# EAGLE design BusPirate-v25 (EAGLE 5.03)
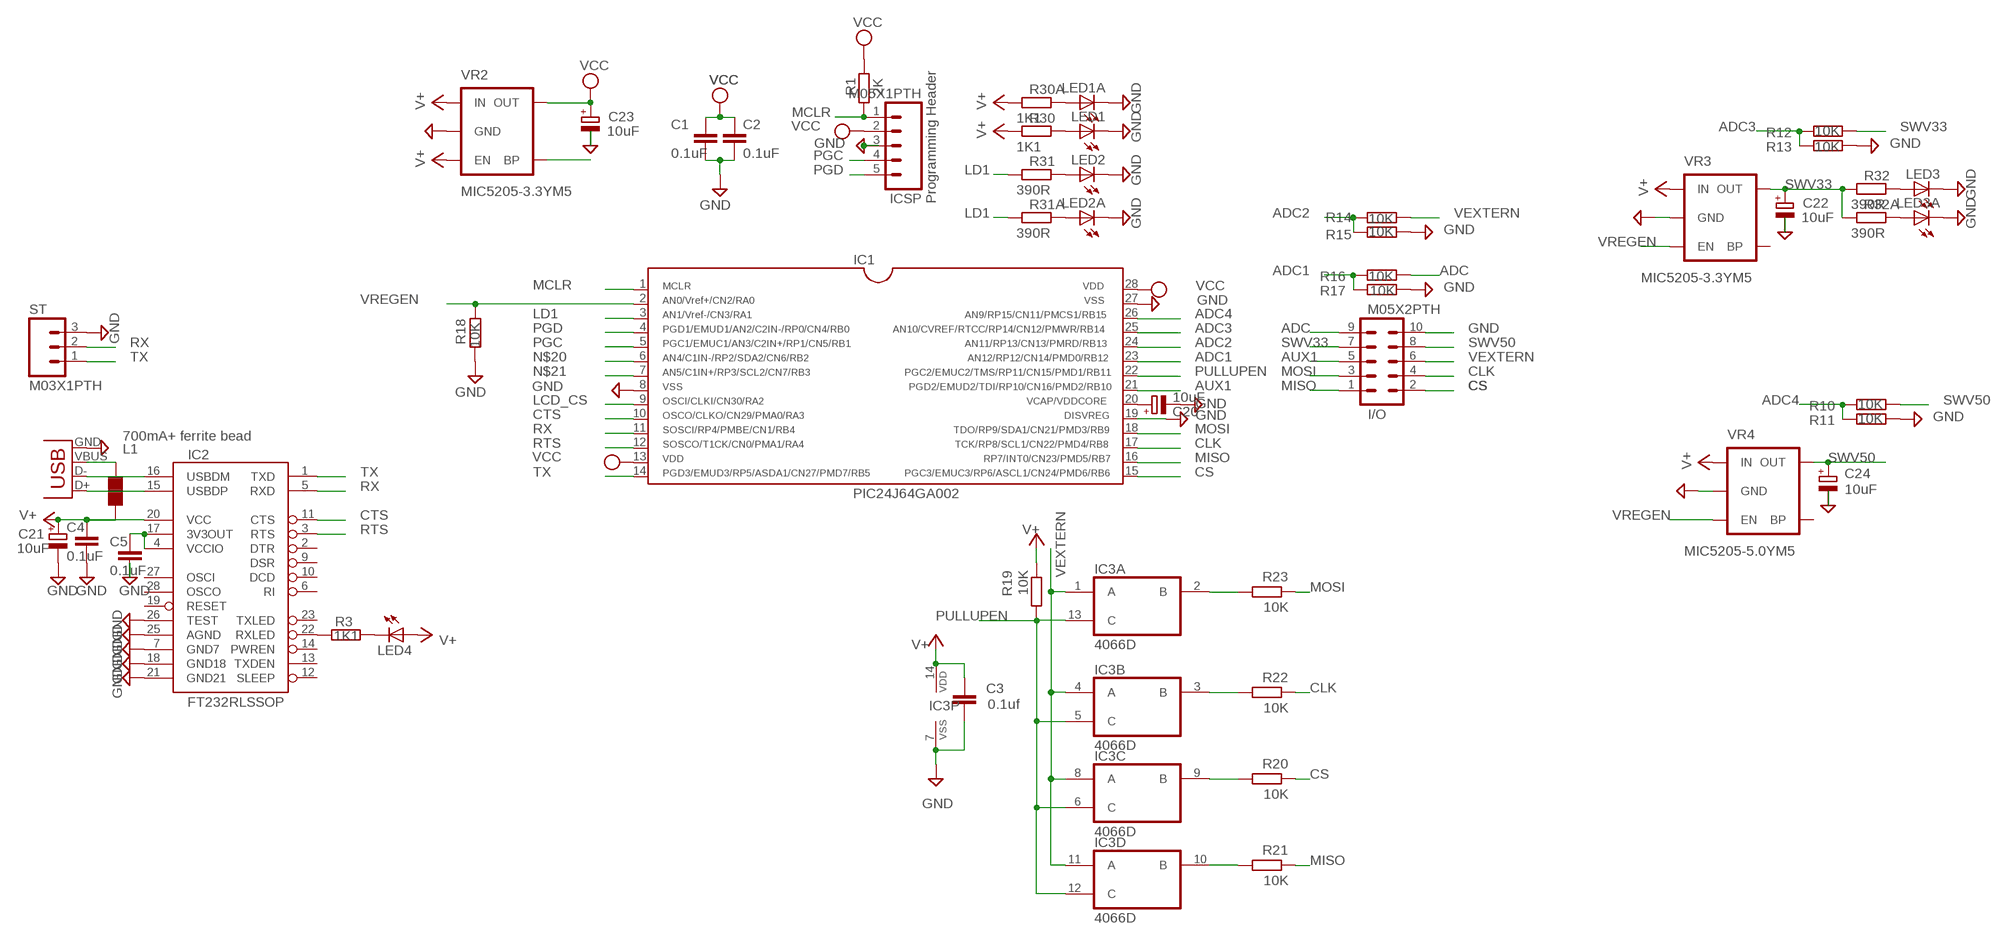
[diagram p0: schematic, sheet 1]

## Parts
C1  0.1uF  C-EUC0805  [C0805]
C2  0.1uF  C-EUC0805  [C0805]
C3  0.1uf  C-EUC0805  [C0805]
C4  0.1uF  C-EUC0805  [C0805]
C5  0.1uF  C-EUC0805  [C0805]
C20  10uF  CPOL-EUSMCA  [SMC_A]
C21  10uF  CPOL-EUSMCA  [SMC_A]
C22  10uF  CPOL-EUSMCA  [SMC_A]
C23  10uF  CPOL-EUSMCA  [SMC_A]
C24  10uF  CPOL-EUSMCA  [SMC_A]
I/O  M05X2PTH  [AVR_ICSP]
IC1  PIC24J64GA002  PIC24FJ64GA002  [SO28W]
IC2  FT232RLSSOP  [SSOP28DB]
IC3  4066D  [SO14]
ICSP  M05X1PTH  M05  [1X05]
J2  USBSMD  [USB-MINIB]
L1  700mA+ ferrite bead  WE-KIL_0805  [WE-KI_0805_B]
LED1  LEDCHIP-LED0805  [CHIP-LED0805]
LED1A  LEDCHIP-LED0805  [CHIP-LED0805]
LED2  LEDCHIP-LED0805  [CHIP-LED0805]
LED2A  LEDCHIP-LED0805  [CHIP-LED0805]
LED3  LEDCHIP-LED0805  [CHIP-LED0805]
LED3A  LEDCHIP-LED0805  [CHIP-LED0805]
LED4  LEDCHIP-LED0805  [CHIP-LED0805]
R1  2K  R-EU_R0805  [R0805]
R3  1K1  R-EU_M0805  [M0805]
R10  10K  R-EU_M0805  [M0805]
R11  10K  R-EU_M0805  [M0805]
R12  10K  R-EU_M0805  [M0805]
R13  10K  R-EU_M0805  [M0805]
R14  10K  R-EU_M0805  [M0805]
R15  10K  R-EU_M0805  [M0805]
R16  10K  R-EU_M0805  [M0805]
R17  10K  R-EU_M0805  [M0805]
R18  10K  R-EU_M0805  [M0805]
R19  10K  R-EU_R0805  [R0805]
R20  10K  R-EU_R0805  [R0805]
R21  10K  R-EU_R0805  [R0805]
R22  10K  R-EU_R0805  [R0805]
R23  10K  R-EU_R0805  [R0805]
R30  1K1  R-EU_M0805  [M0805]
R30A  1K1  R-EU_M0805  [M0805]
R31  390R  R-EU_M0805  [M0805]
R31A  390R  R-EU_M0805  [M0805]
R32  390R  R-EU_M0805  [M0805]
R32A  390R  R-EU_M0805  [M0805]
ST  M03X1PTH  M03PTH  [1X03]
VR2  MIC5205-3.3YM5  V_REG_LDOSMD  [SOT23-5]
VR3  MIC5205-3.3YM5  V_REG_LDOSMD  [SOT23-5]
VR4  MIC5205-5.0YM5  V_REG_LDOSMD  [SOT23-5]

## Nets
$N26: J2.VBUS L1.2
ADC: I/O.9 R16.1
ADC1: IC1.23 R16.2 R17.2
ADC2: IC1.24 R14.2 R15.2
ADC3: IC1.25 R12.2 R13.2
ADC4: IC1.26 R10.2 R11.2
AUX1: I/O.5 IC1.21
CLK: I/O.4 IC1.17 R22.1
CS: I/O.2 IC1.15 R20.1
CTS: IC1.10 IC2.11(CTS)
GND: C1.2 C2.2 C3.2 C4.2 C5.2 C20.- C21.- C22.- C23.- C24.- I/O.10 IC1.8 IC1.19 IC1.27 IC2.7(GND7) IC2.18(GND18) IC2.21(GND21) IC2.25(AGND) IC2.26(TEST) IC3.7(P:VSS) ICSP.3 J2.GND LED1.C LED1A.C LED2.C LED2A.C LED3.C LED3A.C R11.1 R13.1 R15.1 R17.1 R18.2 ST.3 VR2.2(GND) VR3.2(GND) VR4.2(GND)
LCD_CS: IC1.9
LD1: IC1.3 R31.2 R31A.2
MCLR: IC1.1 ICSP.1 R1.1
MISO: I/O.1 IC1.16 R21.1
MOSI: I/O.3 IC1.18 R23.1
N$1: IC3.2(A:B) R23.2
N$2: IC3.3(B:B) R22.2
N$3: C20.+ IC1.20
N$4: IC3.10(D:B) R21.2
N$5: IC3.9(C:B) R20.2
N$6: LED2.A R31.1
N$7: LED1.A R30.1
N$8: VR2.4(BP)
N$9: LED3A.A R32A.1
N$11: IC2.22(RXLED) R3.2
N$13: LED4.C R3.1
N$14: LED2A.A R31A.1
N$15: IC2.15(USBDP) J2.D+
N$16: IC2.16(USBDM) J2.D-
N$17: LED1A.A R30A.1
N$18: LED3.A R32.1
N$20: IC1.6
N$21: IC1.7
PGC: IC1.5 ICSP.4
PGD: IC1.4 ICSP.5
PULLUPEN: IC1.22 IC3.5(B:C) IC3.6(C:C) IC3.12(D:C) IC3.13(A:C) R19.2
RTS: IC1.12 IC2.3(RTS)
RX: IC1.11 IC2.5(RXD) ST.2
SWV33: C22.+ I/O.7 R12.1 R32.2 R32A.2 VR3.5(OUT)
SWV50: C24.+ I/O.8 R10.1 VR4.5(OUT)
TX: IC1.14 IC2.1(TXD) ST.1
USBVCCIO: C5.1 IC2.4(VCCIO) IC2.17(3V3OUT)
V+: C3.1 C4.1 C21.+ IC2.20(VCC) IC3.14(P:VDD) L1.1 LED4.A R19.1 R30.2 R30A.2 VR2.1(IN) VR2.3(EN) VR3.1(IN) VR4.1(IN)
VCC: C1.1 C2.1 C23.+ IC1.13 IC1.28 ICSP.2 R1.2 VR2.5(OUT)
VEXTERN: I/O.6 IC3.1(A:A) IC3.4(B:A) IC3.8(C:A) IC3.11(D:A) R14.1
VREGEN: IC1.2 R18.1 VR3.3(EN) VR4.3(EN)
Unconnected: IC2.2(DTR) IC2.6(RI) IC2.9(DSR) IC2.10(DCD) IC2.12(SLEEP) IC2.13(TXDEN) IC2.14(PWREN) IC2.19(RESET) IC2.23(TXLED) IC2.27(OSCI) IC2.28(OSCO) VR3.4(BP) VR4.4(BP)

## Notes on the sheet
- Programming Header

## Library data of the parts
C1-C5 = rcl:C-EU: CAPACITOR, European symbol
C20-C24 = rcl:CPOL-EU: POLARIZED CAPACITOR, European symbol
I/O = SparkFun:M05X2: Header 5x2 Standard 10-pin dual row 0.1" header. Commonly used with AVR-ISP. Use with Spark Fun Electronics SKU: PRT-00778
IC1 = microchip-pic24:PIC24FJ64GA002
IC2 = SparkFun:FT232RL: USB UART FT232RL 4th Generation USB UART (USB <-> Serial) Controller. Spark Fun Electronics SKU : COM-00650
IC3 = 40xx:4066: Quad bilateral ANALOG SWITCH
ICSP = SparkFun:M05: Header 5 Standard 5-pin 0.1" header. Use with straight break away headers (SKU : PRT-00116), right angle break away headers (PRT-00553), swiss pins (PRT-00743), machine pins (PRT-00117), and female headers (PRT-00115). Molex polarized connector foot print use with SKU : PRT-08230 with associated crimp pins and housings.
J2 = SparkFun:USB: USB Connectors USB-B-PTH is fully proven SKU : PRT-00139 USB-miniB is fully proven SKU : PRT-00587 USB-A-PCB is untested. USB-A-H is throughly reviewed, but untested. Spark Fun Electronics SKU : PRT-00437 USB-B-SMT is throughly reviewed, but untested. Needs silkscreen touching up. USB-A-S has not been used/tested USB-MB-H has not been used/tested
L1 = wuerth-elektronik:WE-KIL: SMD Wire Wound Ceramic Inductor WE-KIL - Low profile - High Q values -- Bluetooth -- Wireless LAN -- RF oscillation circuit -- IF impedance matching
LED1 LED1A LED2 LED2A LED3 LED3A LED4 = led:LED: LED OSRAM: - CHIPLED LG R971, LG N971, LY N971, LG Q971, LY Q971, LO R971, LY R971 LH N974, LH R974 LS Q976, LO Q976, LY Q976 LO Q996 - Hyper CHIPLED LW Q18S LB Q993, LB Q99A, LB R99A - SideLED LS A670, LO A670, LY A670, LG A670, LP A670 LB A673, LV A673, LT A673, LW A673 LH A674 LY A675 LS A676, LA A676, LO A676, LY A676, LW A676 LS A679, LY A679, LG A679 - Hyper Micro SIDELED® LS Y876, LA Y876, LO Y876, LY Y876 LT Y87S - SmartLED LW L88C, LW L88S LB L89C, LB L89S, LG L890 LS L89K, LO L89K, LY L89K LS L896, LA L896, LO L896, LY L896 - TOPLED LS T670, LO T670, LY T670, LG T670, LP T670 LSG T670, LSP T670, LSY T670, LOP T670, LYG T670 LG T671, LOG T671, LSG T671 LB T673, LV T673, LT T673, LW T673 LH T674 LS T676, LA T676, LO T676, LY T676, LB T676, LH T676, LSB T676, LW T676 LB T67C, LV T67C, LT T67C, LS T67K, LO T67K, LY T67K, LW E67C LS E67B, LA E67B, LO E67B, LY E67B, LB E67C, LV E67C, LT E67C LW T67C LS T679, LY T679, LG T679 LS T770, LO T770, LY T770, LG T770, LP T770 LB T773, LV T773, LT T773, LW T773 LH T774 LS E675, LA E675, LY E675, LS T675 LS T776, LA T776, LO T776, LY T776, LB T776 LHGB T686 LT T68C, LB T68C - Hyper Mini TOPLED® LB M676 - Mini TOPLED Santana® LG M470 LS M47K, LO M47K, LY M47K Source: http://www.osram.convergy.de LUXEON: - LUMILED® LXK2-PW12-R00, LXK2-PW12-S00, LXK2-PW14-U00, LXK2-PW14-V00 LXK2-PM12-R00, LXK2-PM12-S00, LXK2-PM14-U00 LXK2-PE12-Q00, LXK2-PE12-R00, LXK2-PE12-S00, LXK2-PE14-T00, LXK2-PE14-U00 LXK2-PB12-K00, LXK2-PB12-L00, LXK2-PB12-M00, LXK2-PB14-N00, LXK2-PB14-P00, LXK2-PB14-Q00 LXK2-PR12-L00, LXK2-PR12-M00, LXK2-PR14-Q00, LXK2-PR14-R00 LXK2-PD12-Q00, LXK2-PD12-R00, LXK2-PD12-S00 LXK2-PH12-R00, LXK2-PH12-S00 LXK2-PL12-P00, LXK2-PL12-Q00, LXK2-PL12-R00 Source: www.luxeon.com KINGBRIGHT: KA-3528ASYC Source: www.kingbright.com
R1 R19-R23 R30 R30A R31 R31A R32 R32A = rcl:R-EU_: RESISTOR, European symbol
R3 R10-R18 = resistor:R-EU_: RESISTOR, European symbol
ST = SparkFun:M03: Header 3 Standard 3-pin 0.1" header. Use with straight break away headers (SKU : PRT-00116), right angle break away headers (PRT-00553), swiss pins (PRT-00743), machine pins (PRT-00117), and female headers (PRT-00115). Molex polarized connector foot print use with SKU : PRT-08232 with associated crimp pins and housings.
VR2-VR4 = SparkFun:V_REG_LDO: Voltage Regulator LDO Standard 150mA LDO voltage regulator in SOT-23 layout. Micrel part MIC5205. BP (by-pass) pin is used to lower output noise with 470pF cap.

## Board
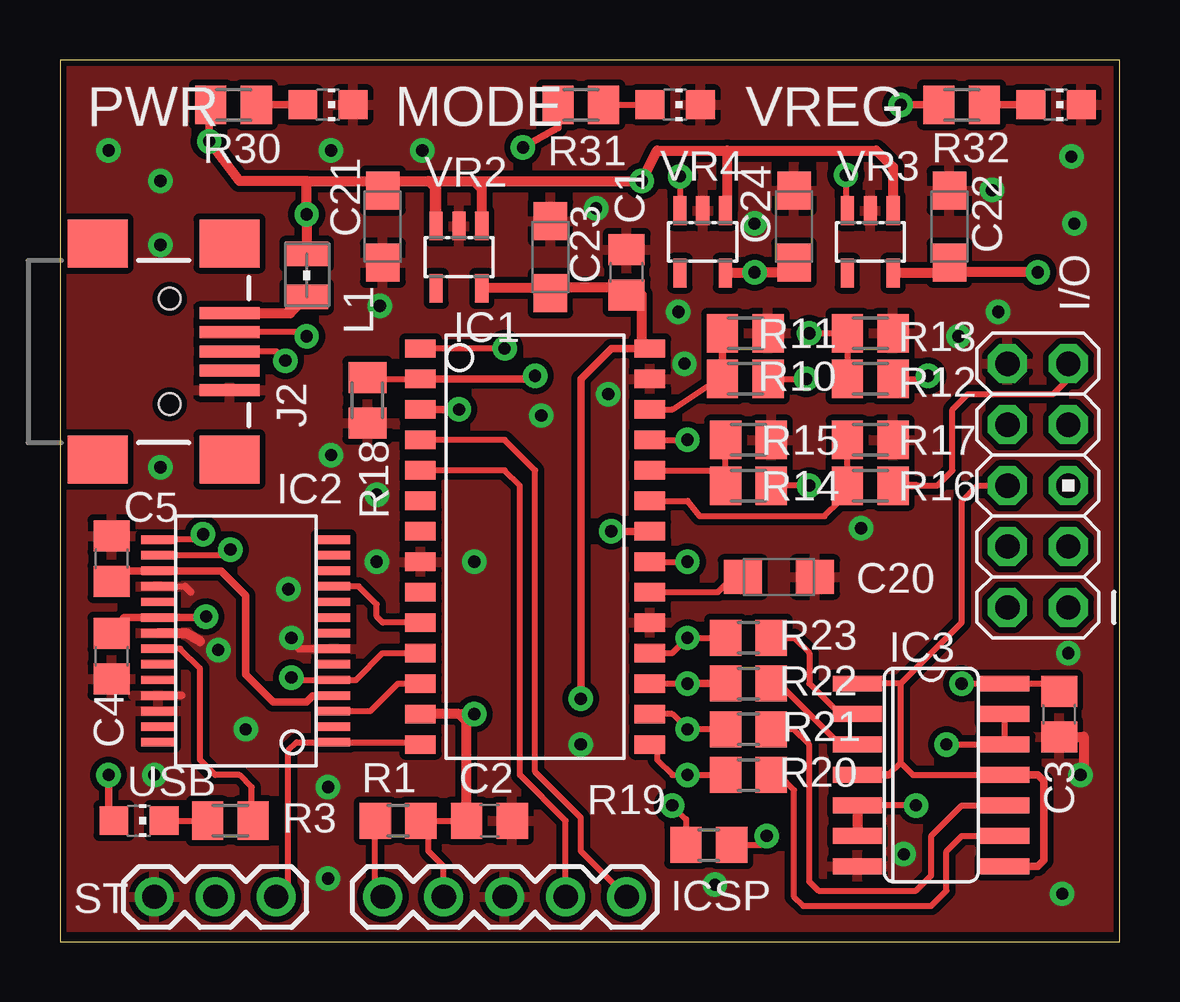
[diagram p1: board, top side]
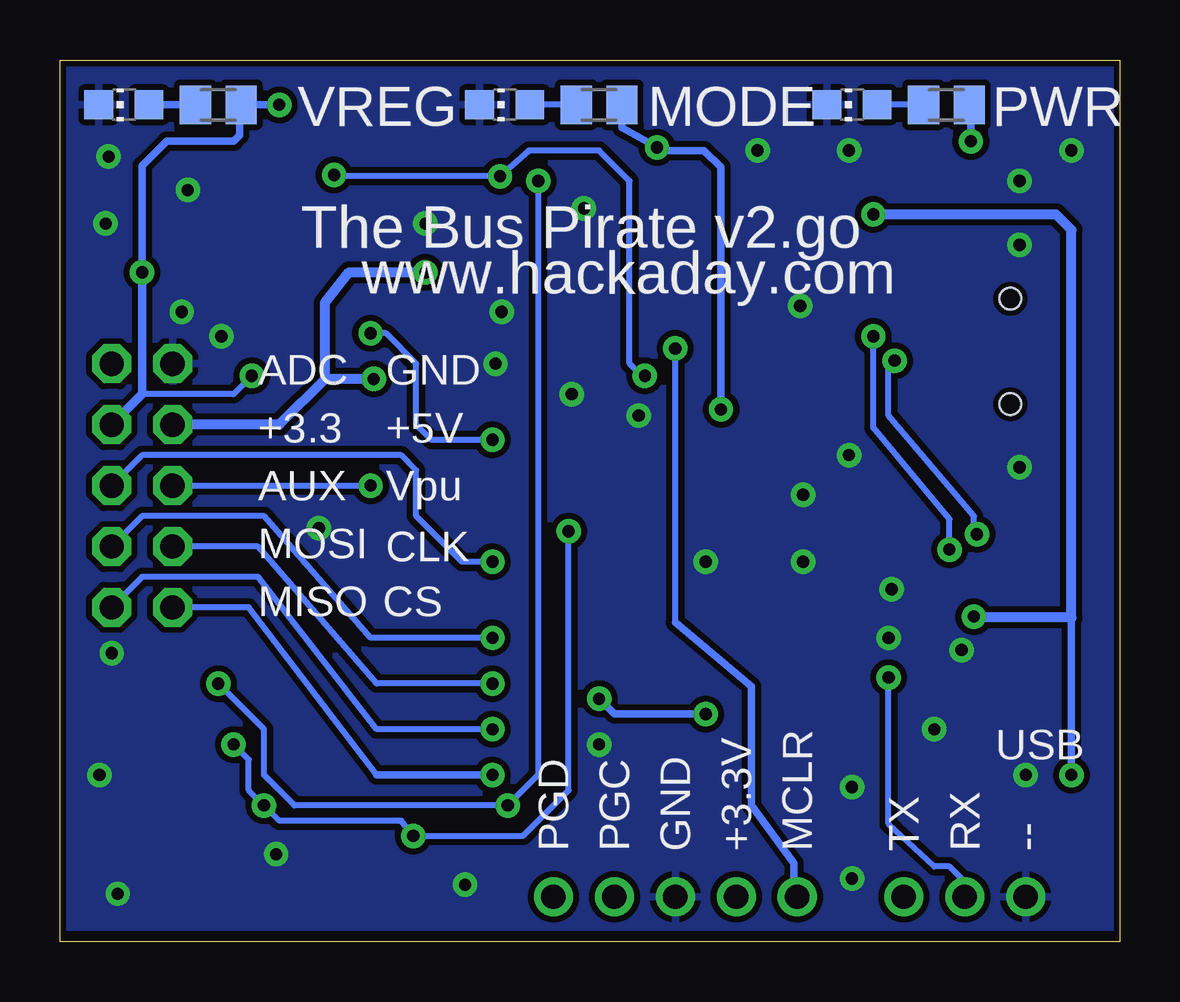
[diagram p2: board, bottom side, seen from below]

Size 44.19 x 36.75 mm. Coordinates in mm from the lower left corner, seen from the top.
Outline: 44.19,0 44.19,36.75 0,36.75 0,0 44.19,0
Copper layers (1*16): Top 0.035mm / dielectric 1.5mm / Bottom 0.035mm
Design rules "SparkFun": minimum track width 8mil, minimum drill 20mil, track to track 8mil, track to pad 8mil, pad to pad 8mil, via to via 8mil, smd to smd 8mil, copper to edge 10mil, drill to drill 8mil, minimum pad ring 12mil, minimum via ring 10mil, stop-mask expansion 4mil, vias tented up to drill 25mil, thermal gap 10mil

### Footprints (pad centres in the part's own frame; a part is rotated, then mirrored left to right if it is on the bottom)
C0805 = smd 1.3 x 1.5: 1 -0.95,0; 2 0.95,0
SMC_A = smd 1.6 x 1.4: + -1.5,0; - 1.5,0
AVR_ICSP = drill 1.016 octagon: 1 -1.27,5.08; 2 1.27,5.08; 3 -1.27,2.54; 4 1.27,2.54; 5 -1.27,0; 6 1.27,0; 7 -1.27,-2.54; 8 1.27,-2.54; 9 -1.27,-5.08; 10 1.27,-5.08
SO28W = smd 0.762 x 1.27: 1 -8.89,-4.78; 2 -7.62,-4.78; 3 -6.35,-4.78; 4 -5.08,-4.78; 5 -3.81,-4.78; 6 -2.54,-4.78; 7 -1.27,-4.78; 8 0,-4.78; 9 1.27,-4.78; 10 2.54,-4.78; 11 3.81,-4.78; 12 5.08,-4.78; 13 6.35,-4.78; 14 7.62,-4.78; 15 7.62,4.78; 16 6.35,4.78; 17 5.08,4.78; 18 3.81,4.78; 19 2.54,4.78; 20 1.27,4.78; 21 0,4.78; 22 -1.27,4.78; 23 -2.54,4.78; 24 -3.81,4.78; 25 -5.08,4.78; 26 -6.35,4.78; 27 -7.62,4.78; 28 -8.89,4.78
SSOP28DB = smd 0.348 x 1.397: 1 -4.225,-3.656; 2 -3.575,-3.656; 3 -2.925,-3.656; 4 -2.275,-3.656; 5 -1.625,-3.656; 6 -0.975,-3.656; 7 -0.325,-3.656; 8 0.325,-3.656; 9 0.975,-3.656; 10 1.625,-3.656; 11 2.275,-3.656; 12 2.925,-3.656; 13 3.575,-3.656; 14 4.225,-3.656; 15 4.225,3.656; 16 3.575,3.656; 17 2.925,3.656; 18 2.275,3.656; 19 1.625,3.656; 20 0.975,3.656; 21 0.325,3.656; 22 -0.325,3.656; 23 -0.975,3.656; 24 -1.625,3.656; 25 -2.275,3.656; 26 -2.925,3.656; 27 -3.575,3.656; 28 -4.225,3.656
SO14 = smd 0.66 x 2.032: 1 -3.81,-3.073; 2 -2.54,-3.073; 3 -1.27,-3.073; 4 0,-3.073; 5 1.27,-3.073; 6 2.54,-3.073; 7 3.81,-3.073; 8 3.81,3.073; 9 2.54,3.073; 10 1.27,3.073; 11 0,3.073; 12 -1.27,3.073; 13 -2.54,3.073; 14 -3.81,3.073
1X05 = drill 1.016 round: 1 0,0; 2 2.54,0; 3 5.08,0; 4 7.62,0; 5 10.16,0
USB-MINIB = smd 2.5 x 0.5: D+ 2.5,0; D- 2.5,0.8; GND 2.5,-1.6; ID 2.5,-0.8; VBUS 2.5,1.6 | smd 2.5 x 2: GND@1 -3,-4.5; GND@2 -3,4.5; GND@3 2.5,4.5; GND@4 2.5,-4.5 | hole 0.9: 0,2.2; 0,-2.2
WE-KI_0805_B = smd 1.02 x 1.78: 1 -0.89,0; 2 0.89,0
CHIP-LED0805 = smd 1.2 x 1.2: A 0,-1.05; C 0,1.05
R0805 = smd 1.3 x 1.5: 1 -0.95,0; 2 0.95,0
M0805 = smd 1.3 x 1.6: 1 -0.95,0; 2 0.95,0
1X03 = drill 1.016 round: 1 0,0; 2 2.54,0; 3 5.08,0
SOT23-5 = smd 0.55 x 1.2: 1 -0.95,-1.3; 2 0,-1.3; 3 0.95,-1.3; 4 0.95,1.3; 5 -0.95,1.3

### Placement (x,y rotation side)
C1  23.62,27.9 90 top
C2  17.9,5.04 0 top
C3  41.65,9.49 270 top
C4  2.15,11.9 270 top
C5  2.15,15.96 90 top
C20  29.97,15.2 0 top
C21  13.46,29.81 270 top
C22  37.08,29.81 90 top
C23  20.44,28.54 90 top
C24  30.6,29.81 90 top
I/O  40.76,19.01 180 top
IC1  19.81,15.84 270 top
IC2  7.74,12.54 90 top
IC3  36.32,6.95 270 top
ICSP  13.46,1.87 0 top
J2  4.57,24.6 0 top
L1  10.28,27.78 270 top
LED1  11.17,34.89 270 top
LED1A  11.17,34.89 90 bottom
LED2  25.65,34.89 270 top
LED2A  25.65,34.89 90 bottom
LED3  41.52,34.89 270 top
LED3A  41.52,34.89 90 bottom
LED4  3.3,5.04 270 top
R1  14.09,5.04 0 top
R3  7.11,5.04 0 top
R10  28.57,23.46 180 top
R11  28.57,25.36 180 top
R12  33.78,23.46 180 top
R13  33.78,25.36 180 top
R14  28.7,19.01 180 top
R15  28.7,20.92 180 top
R16  33.78,19.01 180 top
R17  33.78,20.92 180 top
R18  12.82,22.57 270 top
R19  27.05,4.03 0 top
R20  28.7,6.95 0 top
R21  28.7,8.85 0 top
R22  28.7,10.76 0 top
R23  28.7,12.66 0 top
R30  7.23,34.89 180 top
R30A  7.23,34.89 0 bottom
R31  21.71,34.89 180 top
R31A  21.71,34.89 0 bottom
R32  37.59,34.89 180 top
R32A  37.59,34.89 0 bottom
ST  9.01,1.87 180 top
VR2  16.63,28.54 180 top
VR3  33.78,29.17 180 top
VR4  26.79,29.17 180 top

### Tracks (layer width: path | path; a pad name or v marks a point on that pad's centre or on a via)
$N26
  Top 0.406: J2.VBUS 9.6,26.2 L1.2
ADC
  Top 0.254: I/O.9 42.03,23.46 41.4,22.82 37.84,22.82 37.21,22.19 37.21,19.65 36.57,19.01 35.68,19.01
  Top 0.305: R16.1 35.68,19.01
ADC1
  Top 0.254: IC1.23 26.16,18.38 26.66,17.74 31.87,17.74 32.51,18.38 32.83,18.38 R16.2 R17.2
ADC2
  Top 0.254: IC1.24 27.75,19.65 | 27.75,19.65 R15.2 | 27.75,19.65 R14.2
ADC3  (via drill 0.51)
  Top 0.254: IC1.25 v26.16,20.92 | v31.24,25.36 R13.2 R12.2
  Top 0.305: R13.2 32.83,25.68
  Bottom 0.254: v31.24,25.36 30.6,25.36 29.33,24.09 29.33,21.55 28.7,20.92 v26.16,20.92
ADC4
  Top 0.254: IC1.26 25.52,22.19 27.43,23.46
  Top 0.305: R10.2 R11.2
  Top 0.406: 27.43,23.46 R10.2
AUX1  (via drill 0.51)
  Top 0.254: IC1.21 v26.16,15.84
  Bottom 0.254: v26.16,15.84 27.43,15.84 29.33,17.74 29.33,19.65 29.97,20.28 40.76,20.28 I/O.5
CLK  (via drill 0.51)
  Top 0.254: IC1.17 v26.16,10.76
  Top 0.305: v26.16,10.76 R22.1
  Bottom 0.254: I/O.4 35.94,16.47 30.98,10.76 v26.16,10.76
CS  (via drill 0.51)
  Top 0.254: R20.1 v26.16,6.95 25.52,6.95 24.89,7.58 24.89,7.92 IC1.15
  Top 0.305: IC1.15 24.89,8.22
  Bottom 0.254: I/O.2 36.32,13.93 30.98,6.95
  Bottom 0.305: v26.16,6.95 30.98,6.95
CTS
  Top 0.254: IC1.10 13.46,13.3 13.2,13.55 13.2,14.06 12.45,14.81 IC2.11
GND  (via drill 0.51)
  Top 0.254: IC2.18 5.21,14.81
  Top 0.305: IC2.7 9.97,12.21 9.65,12.54 | 5.21,14.81 5.46,14.57 | IC2.25 5.08,10.26
  Top 0.406: IC2.21 5.26,12.86 5.84,12.54 | C3.2 42.67,8.54 42.67,6.95
  other vias: 2.03,32.98 22.35,30.57 11.3,32.98 4.19,19.77 4.19,29.04 22.86,22.82 35.17,3.64 13.2,15.84 13.33,26.5 11.17,2.63 3.93,6.95 25.78,26.25 9.52,14.69 27.3,2.38 21.71,8.22 41.78,1.99 37.46,25.24 42.03,12.03 33.4,17.23 9.65,12.66 11.17,6.44 42.16,32.73 42.29,29.93 39.11,26.25 42.54,6.95 26.03,24.09 4.19,31.71 6.6,12.15 20.06,21.93 28.95,29.93 38.86,31.33 11.3,20.28 15.11,32.98 13.2,18.63 17.27,15.84 7.74,8.85
  pour Top (isolate 0.254): 0.12,36.79 43.94,36.79 43.94,0.6 0.12,0.6
  pour Bottom (isolate 0.254): 0.12,36.79 43.94,36.79 43.94,0.6 0.12,0.6
LD1  (via drill 0.51)
  Top 0.305: IC1.3 v16.63,22.19 | R31A.2 20.76,33.94 v19.3,33.11
  Bottom 0.305: v16.63,22.19 16.63,32.28 17.33,32.98 19.17,32.98 v19.3,33.11 20.76,33.94 R31A.2
MCLR  (via drill 0.51)
  Top 0.254: v18.54,24.73 IC1.1 | R1.1 13.14,2.18 ICSP.1
  Bottom 0.254: 18.54,13.3 v18.54,24.73 | ICSP.1 13.58,1.99
  Bottom 0.305: 13.58,1.99 13.58,3.26 15.36,5.68 15.36,10.63 18.54,13.3
MISO  (via drill 0.51)
  Top 0.254: IC1.16 25.52,9.49 v26.16,8.85 R21.1
  Bottom 0.254: I/O.1 40.76,15.2 35.94,15.2 30.98,8.85 v26.16,8.85
MOSI  (via drill 0.51)
  Top 0.254: IC1.18 25.52,12.03 v26.16,12.66 R23.1
  Bottom 0.254: I/O.3 40.76,17.74 35.68,17.74 31.24,12.66 v26.16,12.66
N$1
  Top 0.254: IC3.2 32.51,9.49 31.24,10.76 31.24,12.03 30.6,12.66 R23.2
N$2
  Top 0.254: R22.2 29.97,10.76 32.51,8.22 IC3.3
N$3
  Top 0.254: IC1.20 27.43,14.57 28.06,15.2 C20.+
N$4
  Top 0.254: IC3.10 37.59,5.68 36.32,4.41 36.32,2.76 35.68,2.12 31.62,2.12 31.24,2.5 31.24,8.22 30.6,8.85 R21.2
N$5
  Top 0.254: IC3.9 37.59,4.41 36.95,3.77 36.95,2.12 36.32,1.49 30.98,1.49 30.6,1.87 30.6,6.31 29.97,6.95 R20.2
N$6
  Top 0.254: R31.1 LED2.A
N$7
  Top 0.305: R30.1 LED1.A
N$9
  Bottom 0.305: LED3A.A R32A.1
N$11
  Top 0.254: IC2.22 5.02,12.21 5.84,11.39 5.84,7.58 6.47,6.95 7.49,6.95 8,6.44 8,5.1 R3.2 8.38,5.36
N$13
  Top 0.254: LED4.C R3.1
N$14
  Bottom 0.254: R31A.1 LED2A.A
N$15  (via drill 0.51)
  Top 0.254: IC2.15 4.06,16.79 5.77,16.79 v5.96,16.98 | J2.D+ 9.01,24.6 v9.39,24.22
  Bottom 0.254: v9.39,24.22 9.65,23.96 9.65,21.93 6.09,17.74 6.09,17.11 v5.96,16.98
N$16  (via drill 0.51)
  Top 0.254: 4.1,16.09 IC2.16 6.87,16.11 v7.11,16.35 | J2.D- 10.12,25.4 v10.28,25.24
  Bottom 0.254: v10.28,25.24 10.28,21.43 7.11,17.61 v7.11,16.35
N$17
  Bottom 0.254: R30A.1 LED1A.A
N$18
  Top 0.305: R32.1 LED3.A
PGC
  Top 0.254: IC1.5 18.54,19.65 19.17,19.01 19.17,6.95 21.08,5.04 ICSP.4
PGD
  Top 0.254: IC1.4 18.54,20.92 19.81,19.65 19.81,7.07 21.71,5.17 21.71,3.77 ICSP.5
PULLUPEN  (via drill 0.51)
  Top 0.254: v36.95,8.22 IC3.12 IC3.13 | v35.68,5.68 IC3.5 | R19.2 29.21,4.03 v29.46,4.41
  Top 0.305: v22.98,17.11 IC1.22
  Top 0.406: IC3.5 IC3.6
  Bottom 0.254: v36.95,8.22 36.32,7.58 36.32,6.31 v35.68,5.68 35.05,5.04 29.97,5.04 v29.46,4.41 24.89,4.41 22.98,6.31 v22.98,17.11
RTS
  Top 0.254: IC2.3 12.95,9.61 14.09,10.76 IC1.12
RX  (via drill 0.51)
  Top 0.254: v9.65,11.01 9.75,10.91 IC2.5 12.34,10.91 13.46,12.03 IC1.11
  Bottom 0.254: v9.65,11.01 9.65,4.91 7.74,3.14 7.11,3.14 6.47,2.5 ST.2
SWV33  (via drill 0.51)
  Top 0.254: R12.1 36.06,23.46
  Top 0.305: v35.05,34.89 R32A.2 | 36.06,23.46 v36.19,23.58
  Top 0.406: v40.76,27.9 37.08,27.9 | VR3.5 37.08,27.87 37.08,27.9 | 37.08,27.9 C22.+
  Bottom 0.254: 40.76,22.82 36.95,22.82 v36.19,23.58
  Bottom 0.305: v35.05,34.89 R32A.2 36.7,34.83 36.7,33.62 36.95,33.36 39.75,33.36 40.76,32.35 v40.76,27.9
  Bottom 0.356: I/O.7 40.76,22.82 v40.76,27.9
SWV50  (via drill 0.51)
  Top 0.254: R10.1 v31.11,23.46
  Top 0.406: VR4.5 28.92,27.87 v28.95,27.9 30.6,27.9 C24.+
  Bottom 0.406: 33.14,23.46 35.05,21.55 I/O.8 | v31.11,23.46 33.14,23.46 | v28.95,27.9 32.13,27.9 33.14,26.63 33.14,23.46
TX
  Top 0.254: IC1.14 14.93,8.31 IC2.1 9.87,8.31 9.52,7.96 9.52,2.38 ST.1
USBVCCIO
  Top 0.305: IC2.4 11.39,10.25 10.54,10.25 10.28,10 8.88,10 7.74,11.14 7.74,14.44 6.72,15.46 IC2.17 2.34,15.46 C5.1
V+  (via drill 0.51)
  Top 0.254: v37.59,10.76 IC3.14 41.33,10.76 C3.1 | R19.1 26.1,5.1 v25.52,5.68
  Top 0.305: VR2.3 15.62,29.77 | 2.68,13.51 IC2.20 | 2.68,13.51 C4.1 | 2.68,13.51 6.05,13.51 v6.09,13.55 | LED4.A 2.03,5.04 v2.03,6.95 | v6.22,33.36 6.22,34.82 R30.2
  Top 0.406: 15.62,29.77 15.62,31.46 15.36,31.71 | 13.46,31.71 15.36,31.71 | 10.28,31.71 13.46,31.71 | VR2.3 15.68,31.39 15.36,31.71 | 15.36,31.71 17.27,31.71 | VR2.1 17.58,31.4 17.27,31.71 | VR4.1 27.81,30.54 27.81,32.98 | 10.28,31.71 7.49,31.71 v6.22,33.36 | VR3.1 34.73,32.29 34.03,32.98 27.81,32.98 | 17.27,31.71 v24.25,31.71 24.89,32.98 27.81,32.98 | 10.41,28.54 L1.1 v10.28,30.32 10.28,31.71 | 13.46,31.71 C21.+
  Bottom 0.254: v24.25,31.71 24.25,6.95 v25.52,5.68 34.41,5.68 35.68,6.95 35.68,8.85 v37.59,10.76
  Bottom 0.305: v2.03,6.95 2.03,13.51 | v6.22,33.36 6.22,34.82 R30.2
  Bottom 0.406: v10.28,30.32 2.66,30.32 2.03,29.68 2.03,13.51 6.05,13.51 v6.09,13.55
VCC  (via drill 0.51)
  Top 0.254: C2.1 R1.2 15.36,4.72 15.36,3.77 16,3.14 ICSP.2 | 16.95,9.17
  Top 0.305: 24.25,26.95 C1.1 | IC1.28 22.98,24.73 21.71,23.46 v21.71,10.12
  Top 0.406: 16.63,9.49 IC1.13 | 16.63,9.49 v17.27,9.49 | 24.25,26.95 24.25,25.06 IC1.28 | C23.+ 20.44,27.27 23.62,27.27 C1.1 | C23.+ 20.44,26.95 | C2.1 16.95,9.17 | 16.95,9.17 16.63,9.49 | VR2.5 20.24,27.24 C23.+
  Bottom 0.305: v17.27,9.49 21.08,9.49 v21.71,10.12
VEXTERN  (via drill 0.51)
  Top 0.254: v31.24,19.01 R14.1 | 35.05,7.45 35.05,10.76 | 35.05,10.76 IC3.1 | 35.05,10.76 37.59,13.3 37.59,18.38 38.22,19.01 I/O.6 | IC3.11 35.55,6.95 35.05,7.45 | 34.54,6.95 35.05,7.45
  Top 0.305: IC3.11 40.76,6.95 41.02,6.69 41.02,3.39 40.76,3.14 IC3.8 | IC3.4 34.54,6.95
  Bottom 0.254: I/O.6 v31.24,19.01
VREGEN  (via drill 0.51)
  Top 0.254: v25.84,31.9 25.84,30.76 | IC1.2 13.4,23.46 R18.1 | v32.76,31.97 32.76,30.54 VR3.3
  Top 0.305: 25.84,30.76 VR4.3 | IC1.2 19.68,23.46 v19.81,23.58
  Bottom 0.254: 32.76,31.84 v32.76,31.97 32.63,31.9 v25.84,31.9 24.64,32.98 21.71,32.98 20.44,31.71 20.44,24.09 19.93,23.58 19.93,23.46
  Bottom 0.305: v19.81,23.58 19.93,23.46

### Text on the board
tNames: PWR | MODE | VREG | USB
bNames: PWR | MODE | VREG | The Bus Pirate v2.go | www.hackaday.com | GND | ADC | +5V | +3.3 | Vpu | AUX | CLK | MOSI | CS | MISO | USB | -- | RX | TX | MCLR | +3.3V | GND | PGC | PGD
Document: USB | GND | ADC | +5v | +3v | Vpu | AUX1 | CLK | MOSI | CS | MISO | I/O header | MCLR | +3.3V | GND | CLOCK | DATA | TX | RX | GND | Serial port | Programming Header